# EAGLE design M307X (EAGLE 6.6.0)
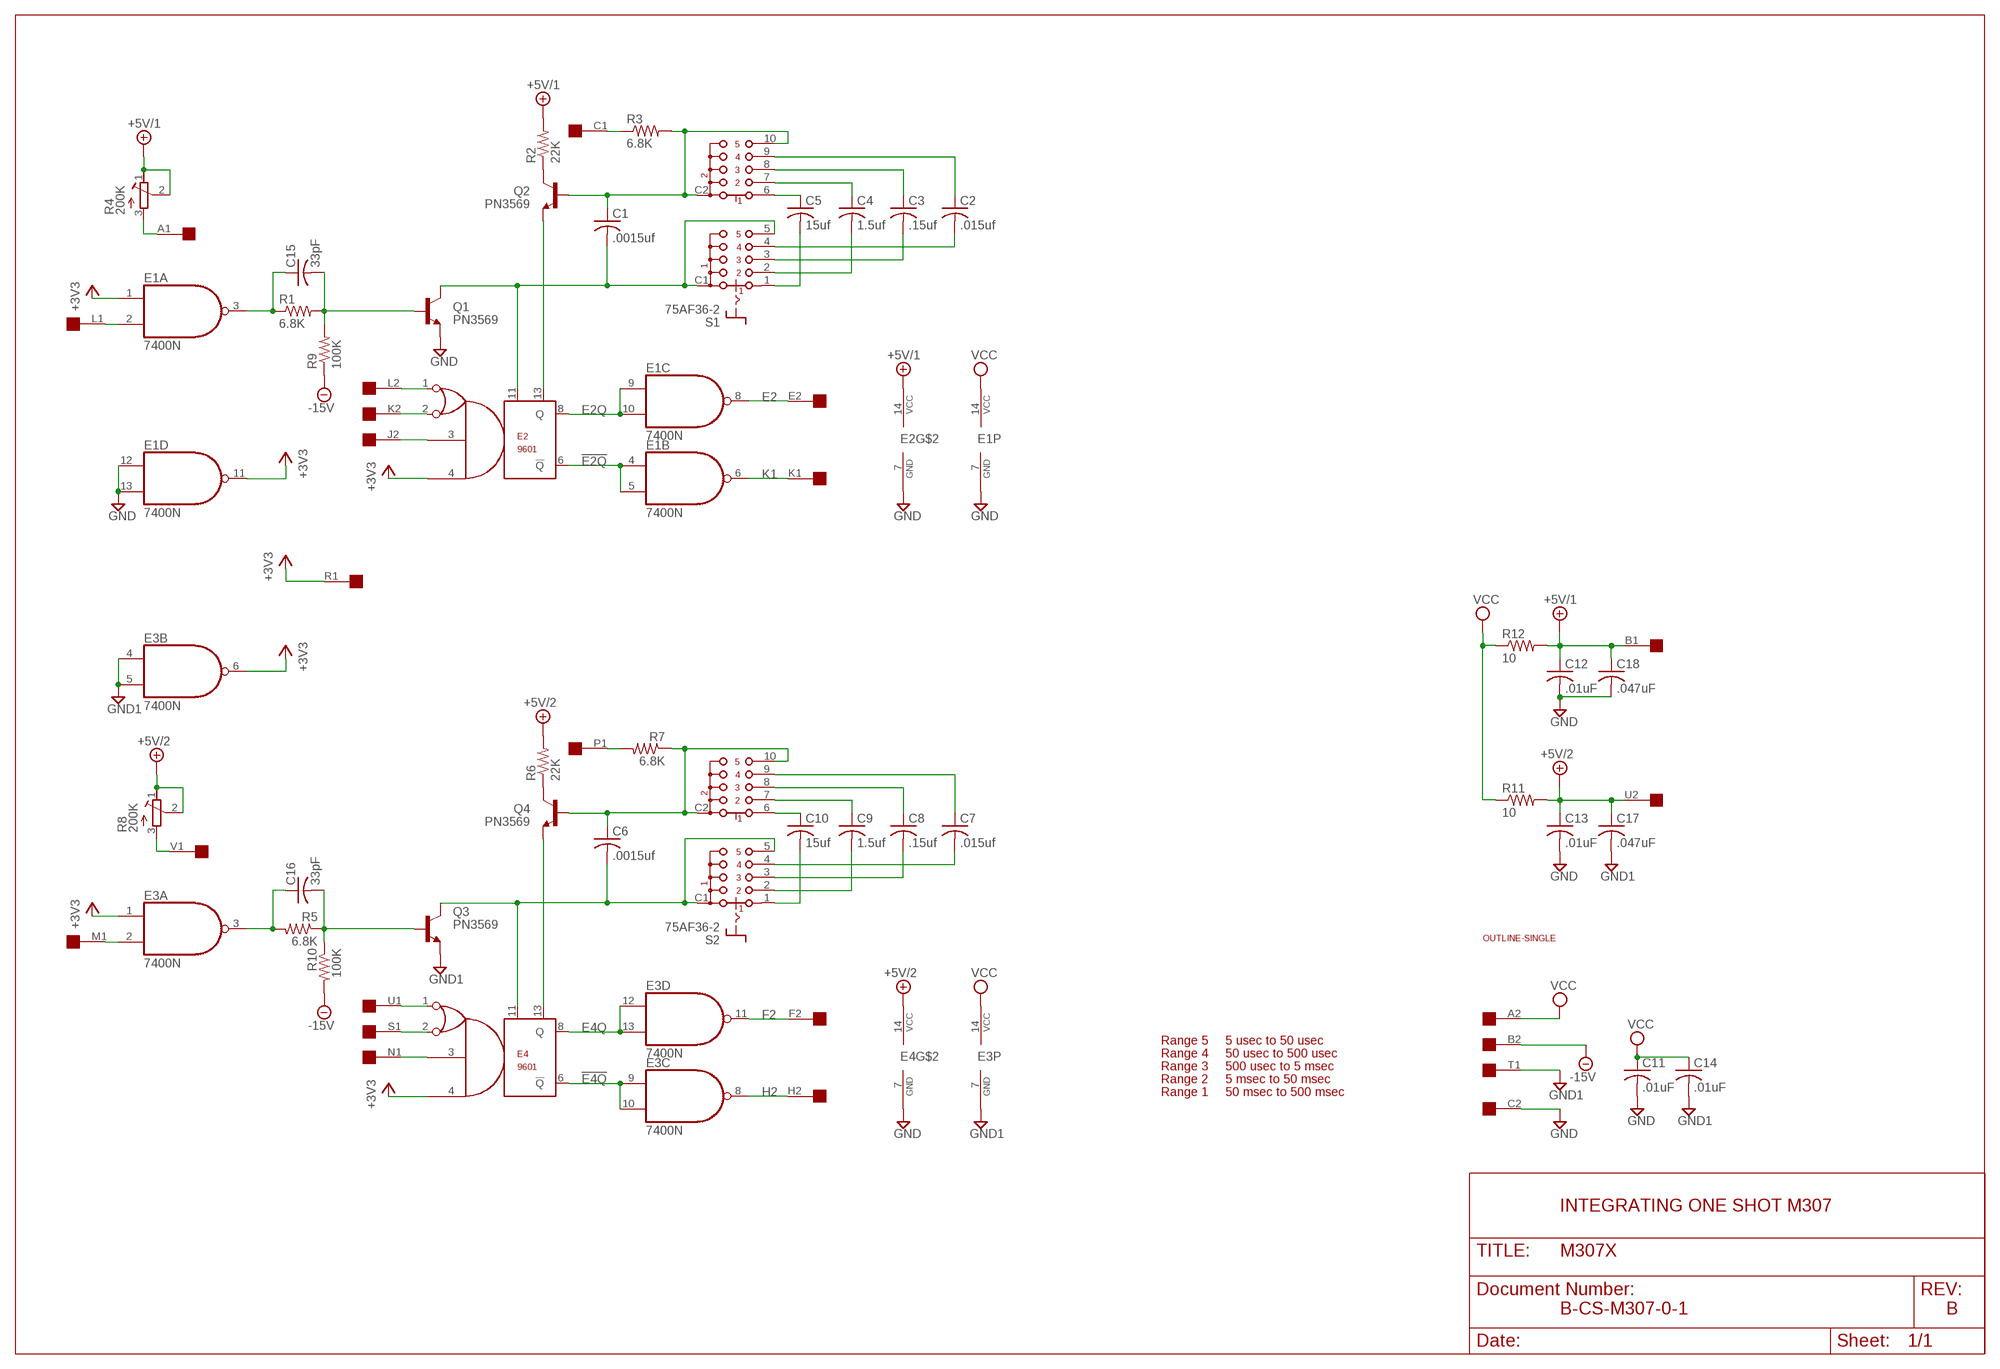
[diagram p0: schematic, sheet 1]

## Parts
C1  .0015uf  C-US050-025X075  [C050-025X075]
C2  .015uf  C-US150-054X183  [C150-054X183]
C3  .15uf  C-US150-054X183  [C150-054X183]
C4  1.5uf  C-US150-054X183  [C150-054X183]
C5  15uf  C-US150-054X183  [C150-054X183]
C6  .0015uf  C-US050-025X075  [C050-025X075]
C7  .015uf  C-US150-054X183  [C150-054X183]
C8  .15uf  C-US150-054X183  [C150-054X183]
C9  1.5uf  C-US150-054X183  [C150-054X183]
C10  15uf  C-US150-054X183  [C150-054X183]
C11  .01uF  C-US050-025X075  [C050-025X075]
C12  .01uF  C-US050-025X075  [C050-025X075]
C13  .01uF  C-US050-025X075  [C050-025X075]
C14  .01uF  C-US050-025X075  [C050-025X075]
C15  33pF  C-US050-025X075  [C050-025X075]
C16  33pF  C-US050-025X075  [C050-025X075]
C17  .047uF  C-US050-025X075  [C050-025X075]
C18  .047uF  C-US050-025X075  [C050-025X075]
E1  7400N  [DIL14]
E2  9601  [DIL14]
E3  7400N  [DIL14]
E4  9601  [DIL14]
Q1  PN3569  2N3019-NPN-TO39-EBC  [TO39]
Q2  PN3569  2N3019-NPN-TO39-EBC  [TO39]
Q3  PN3569  2N3019-NPN-TO39-EBC  [TO39]
Q4  PN3569  2N3019-NPN-TO39-EBC  [TO39]
R1  6.8K  R-US_0207/10  [0207/10]
R2  22K  R-US_0207/10  [0207/10]
R3  6.8K  R-US_0207/10  [0207/10]
R4  200K  275P  [3006Y]
R5  6.8K  R-US_0207/10  [0207/10]
R6  22K  R-US_0207/10  [0207/10]
R7  6.8K  R-US_0207/10  [0207/10]
R8  200K  275P  [3006Y]
R9  100K  R-US_0207/10  [0207/10]
R10  100K  R-US_0207/10  [0207/10]
R11  10  R-US_0207/10  [0207/10]
R12  10  R-US_0207/10  [0207/10]
S1  75AF36-2  [75AF36-2]
S2  75AF36-2  [75AF36-2]
U$1  OUTLINE-SINGLE  [SINGLE]
U$4  SINGLE  [EDGE-CON2]

## Nets
!E2Q: E1.4(B:I0) E1.5(B:I1) E2.6(!Q)
!E4Q: E3.9(C:I0) E3.10(C:I1) E4.6(!Q)
+3V3: E1.1(A:I0) E1.11(D:O) E2.4 E3.1(A:I0) E3.6(B:O) E4.4 U$4.R1
+5V/1: C12.1 C18.1 E2.14(VCC) R2.2 R4.1(A) R4.2(S) R12.2 U$4.B1
+5V/2: C13.1 C17.1 E4.14(VCC) R6.2 R8.1(A) R8.2(S) R11.2 U$4.U2
-15V: R9.1 R10.2 U$4.B2
A1: R8.3(E) U$4.V1
C1: R3.1 U$4.C1
E2: E1.8(C:O) U$4.E2
E2Q: E1.9(C:I0) E1.10(C:I1) E2.8(Q)
E4Q: E3.12(D:I0) E3.13(D:I1) E4.8(Q)
F2: E3.11(D:O) U$4.F2
GND [power]: C11.2 C12.2 C13.2 C18.2 E1.7(P:GND) E1.12(D:I0) E1.13(D:I1) E2.7(GND) E4.7(GND) Q1.1(E) U$4.C2
GND1 [power]: C14.2 C17.2 E3.4(B:I0) E3.5(B:I1) E3.7(P:GND) Q3.1(E) U$4.T1
H2: E3.8(C:O) U$4.H2
J1: C16.2 Q3.2(B) R5.1 R10.1
J2: E2.3 U$4.J2
K1: E1.6(B:O) U$4.K1
K2: E2.2 U$4.K2
L1: E1.2(A:I1) U$4.L1
L2: E2.1 U$4.L2
M1: E3.2(A:I1) U$4.M1
N1: E4.3 U$4.N1
N$1: E4.13 Q4.1(E)
N$2: C15.1 E1.3(A:O) R1.1
N$3: C16.1 E3.3(A:O) R5.2
N$4: C5.1 S1.6
N$5: C6.2 E4.11 Q3.3(C) S2.5 S2.C1
N$6: C4.1 S1.7
N$7: C3.1 S1.8
N$8: C2.1 S1.9
N$9: C2.2 S1.4
N$10: C3.2 S1.3
N$11: C4.2 S1.2
N$12: C5.2 S1.1
N$13: C10.1 S2.6
N$14: C9.1 S2.7
N$15: C8.1 S2.8
N$16: C7.1 S2.9
N$17: C10.2 S2.1
N$18: C9.2 S2.2
N$19: C8.2 S2.3
N$20: C7.2 S2.4
N$21: C1.1 Q2.2(B) R3.2 S1.10 S1.C2
N$22: C1.2 E2.11 Q1.3(C) S1.5 S1.C1
N$24: C6.1 Q4.2(B) R7.1 S2.10 S2.C2
N$25: E2.13 Q2.1(E)
N$26: Q2.3(C) R2.1
N$28: Q4.3(C) R6.1
N$29: C15.2 Q1.2(B) R1.2 R9.2
P1: R7.2 U$4.P1
S1: E4.2 U$4.S1
U1: E4.1 U$4.U1
V1: R4.3(E) U$4.A1
VCC [power]: C11.1 C14.1 E1.14(P:VCC) E3.14(P:VCC) R11.1 R12.1 U$4.A2
Unconnected: U$4.D1 U$4.D2 U$4.E1 U$4.F1 U$4.H1 U$4.J1 U$4.M2 U$4.N2 U$4.P2 U$4.R2 U$4.S2 U$4.T2 U$4.V2

## Notes on the sheet
- Range 5 | 5 usec to 50 usec
- Range 4 | 50 usec to 500 usec
- Range 3 | 500 usec to 5 msec
- Range 2 | 5 msec to 50 msec
- Range 1 | 50 msec to 500 msec
- INTEGRATING ONE SHOT M307
- B-CS-M307-0-1 | B

## Library data of the parts
C1-C18 = rcl:C-US: CAPACITOR, American symbol
E1 E3 = 74xx-us:74*00: Quad 2-input NAND gate
E2 E4 = dec-con:9601: DEC9601 monstable
Q1-Q4 = transistor:*-NPN-: NPN Transistror BF959 corrected 2008.03.06
R1-R3 R5-R7 R9-R12 = rcl:R-US_: RESISTOR, American symbol
R4 R8 = dec-con:275P: Trimpot with 275P (3006Y) footprint.
S1 S2 = dec-con:75?36-2: Single Deck Rotary Switches Source: www.grayhill.com .. J-13-14.pdf
U$1 = dec-con:OUTLINE-*: Board outlines for DEC boards.
U$4 = dec-con:SINGLE: Single-Height DEC board

## Net classes
1 power: width 0.813 mm

## Board
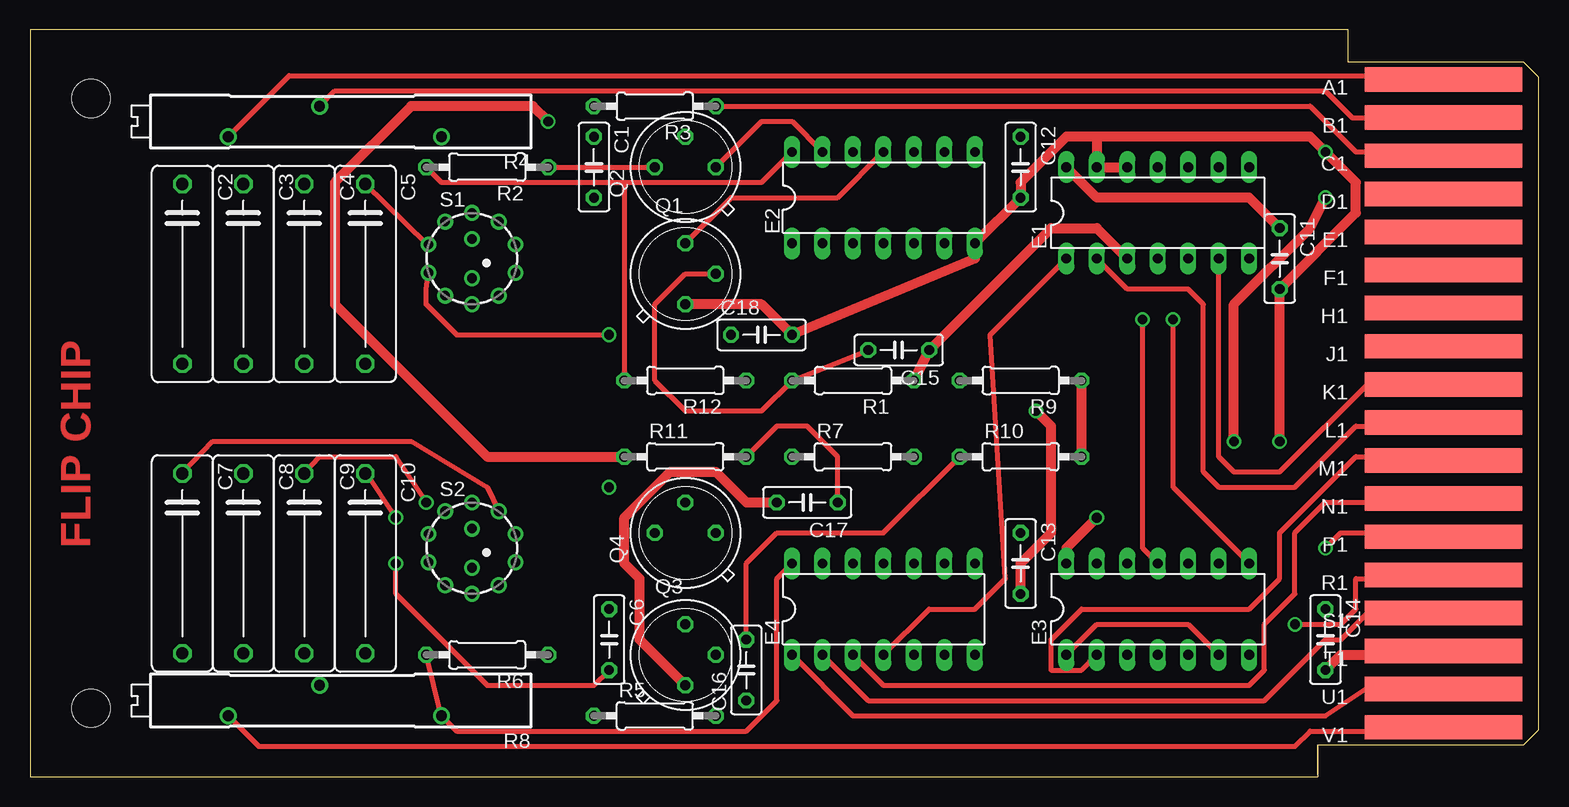
[diagram p1: board, top side]
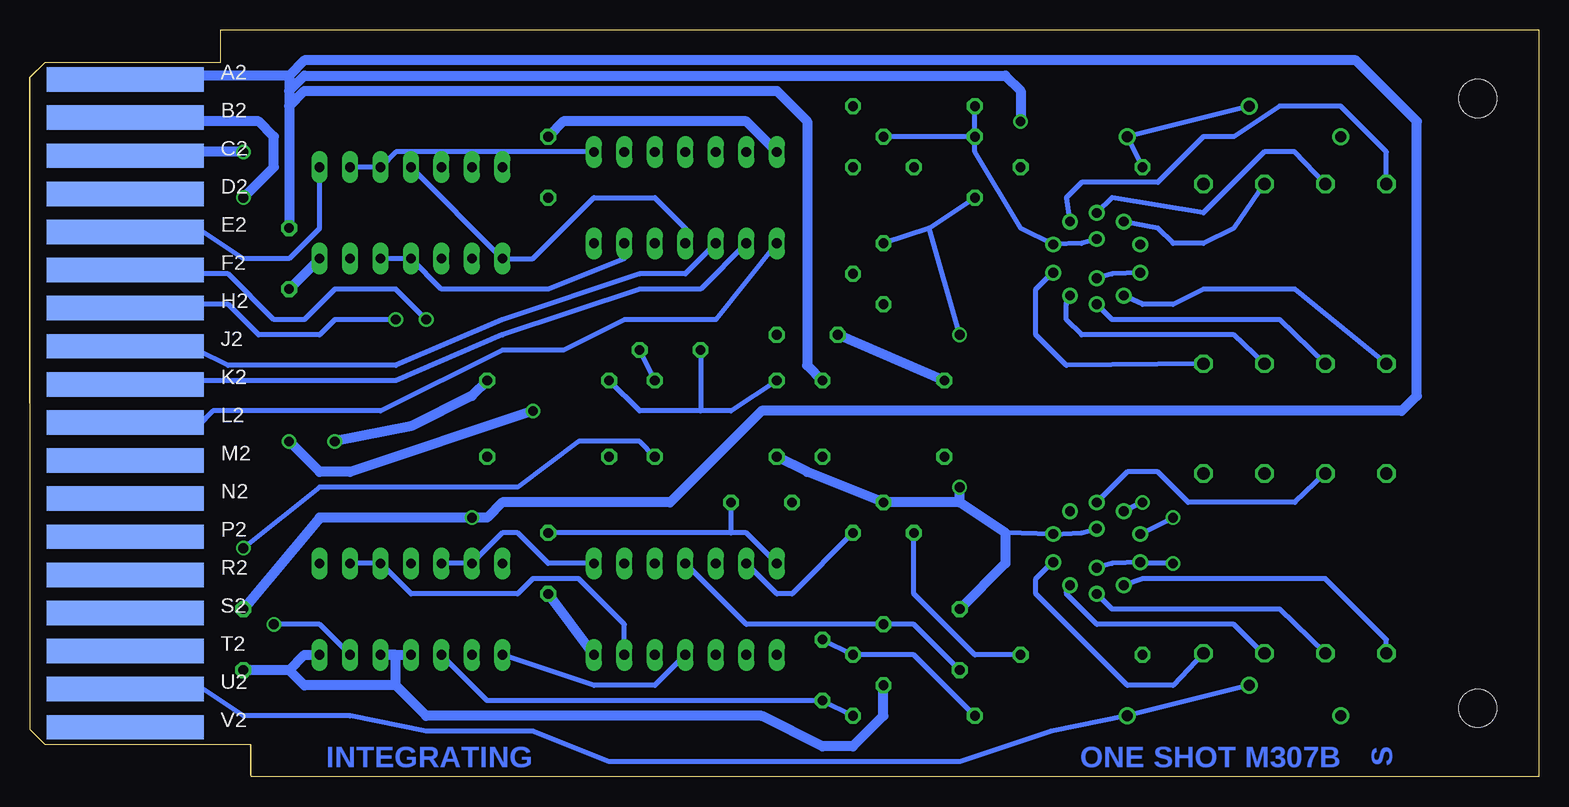
[diagram p2: board, bottom side, seen from below]

Size 125.73 x 62.23 mm. Coordinates in mm from the lower left corner, seen from the top.
Copper layers (1+16): Top 0.035mm / dielectric 1.5mm / Bottom 0.035mm
Design rules "16mils": minimum track width 16mil, minimum drill 32mil, track to track 15mil, track to pad 10mil, pad to pad 10mil, via to via 10mil, smd to smd 10mil, copper to edge 13mil, drill to drill 10mil, minimum pad ring 10mil, minimum via ring 8mil, stop-mask expansion 0mil, vias tented up to drill 0mil, thermal gap 10mil

### Footprints (pad centres in the part's own frame; a part is rotated, then mirrored left to right if it is on the bottom)
C050-025X075 = drill 0.813 octagon: 1 -2.54,0; 2 2.54,0
C150-054X183 = drill 1.016 octagon: 1 -7.493,0; 2 7.493,0
DIL14 = drill 0.813 long: 1 -7.62,-3.81; 2 -5.08,-3.81; 3 -2.54,-3.81; 4 0,-3.81; 5 2.54,-3.81; 6 5.08,-3.81; 7 7.62,-3.81; 8 7.62,3.81; 9 5.08,3.81; 10 2.54,3.81; 11 0,3.81; 12 -2.54,3.81; 13 -5.08,3.81; 14 -7.62,3.81
TO39 = drill 0.813 octagon: 1 0,-2.54; 2 2.54,0; 3 0,2.54
0207/10 = drill 0.813 octagon: 1 -5.08,0; 2 5.08,0
3006Y = drill 0.9: 1 -8.89,1.27; 2 1.27,-1.27; 3 8.89,1.27
75AF36-2 = drill 0.813: 1 3.623,-1.177; 2 2.239,-3.082; 3 0,-3.81; 4 -2.239,-3.082; 5 -3.623,-1.177; 6 -3.623,1.177; 7 -2.239,3.082; 8 0,3.81; 9 2.239,3.082; 10 3.623,1.177; C1 0,-1.63; C2 0,1.63
SINGLE = hole 3.175: 120.65,56.515; 120.65,5.715
EDGE-CON2 = smd 13.106 x 2.032: A1 7.938,4.128; B1 7.938,7.303; C1 7.938,10.477; D1 7.938,13.652; E1 7.938,16.828; F1 7.938,20.003; H1 7.938,23.177; J1 7.938,26.352; K1 7.938,29.527; L1 7.938,32.703; M1 7.938,35.877; N1 7.938,39.053; P1 7.938,42.227; R1 7.938,45.403; S1 7.938,48.578; T1 7.938,51.752; U1 7.938,54.928; V1 7.938,58.102 | smd 13.106 x 2.032 bottom: A2 7.938,4.128; B2 7.938,7.303; C2 7.938,10.477; D2 7.938,13.652; E2 7.938,16.828; F2 7.938,20.003; H2 7.938,23.177; J2 7.938,26.352; K2 7.938,29.527; L2 7.938,32.703; M2 7.938,35.877; N2 7.938,39.053; P2 7.938,42.227; R2 7.938,45.403; S2 7.938,48.578; T2 7.938,51.752; U2 7.938,54.928; V2 7.938,58.102

### Placement (x,y rotation side)
C1  46.99,50.8 270 top
C2  12.7,41.91 270 top
C3  17.78,41.91 270 top
C4  22.86,41.91 270 top
C5  27.94,41.91 270 top
C6  48.26,11.43 270 top
C7  12.7,17.78 270 top
C8  17.78,17.78 270 top
C9  22.86,17.78 270 top
C10  27.94,17.78 270 top
C11  104.14,43.18 270 top
C12  82.55,50.8 270 top
C13  82.55,17.78 270 top
C14  107.95,11.43 270 top
C15  72.39,35.56 180 top
C16  59.69,8.89 90 top
C17  64.77,22.86 180 top
C18  60.96,36.83 0 top
E1  93.98,46.99 0 top
E2  71.12,48.26 0 top
E3  93.98,13.97 0 top
E4  71.12,13.97 0 top
Q1  54.61,41.91 0 top
Q2  54.61,50.8 90 top
Q3  54.61,10.16 0 top
Q4  54.61,20.32 90 top
R1  68.58,33.02 180 top
R2  38.1,50.8 180 top
R3  52.07,55.88 180 top
R4  25.4,54.61 180 top
R5  52.07,5.08 0 top
R6  38.1,10.16 180 top
R7  68.58,26.67 0 top
R8  25.4,6.35 180 top
R9  82.55,33.02 180 top
R10  82.55,26.67 0 top
R11  54.61,26.67 0 top
R12  54.61,33.02 180 top
S1  36.83,43.18 0 top
S2  36.83,19.05 0 top
U$1  125.73,62.23 180 top
U$3  [FLIPCHIP]  0,0 0 top
U$4  125.73,62.23 180 top

### Tracks (layer width: path | path; a pad name or v marks a point on that pad's centre or on a via)
!E2Q
  Bottom 0.406: E1.5 E1.4 91.44,40.64 82.55,40.64 76.2,43.18 E2.6
!E4Q
  Bottom 0.406: E3.9 E3.10 93.98,15.24 85.09,15.24 83.82,16.51 80.01,16.51 76.2,12.7 E4.6
+3V3  (via drill 0.81)
  Top 0.406: v105.41,12.7 109.22,12.7 110.49,13.97 110.49,16.51 116.84,16.51 U$4.R1 | E3.1 88.9,12.7 96.52,12.7 E3.6 | E1.1 80.01,36.83 81.28,16.51 78.74,13.97 74.93,13.97 E4.4
  Bottom 0.406: E4.4 73.66,7.62 78.74,7.62 E3.1 | E2.4 71.12,45.72 73.66,48.26 78.74,48.26 83.82,43.18 E1.1 E1.11 | E3.6 101.6,12.7 v105.41,12.7
+5V/1
  Top 0.406: U$4.B1 110.2,54.9 107.95,57.15 25.4,57.15 R4.2 | R2.2 34.29,49.53 49.53,49.53 | 49.53,49.53 60.96,49.53 E2.14 | 49.53,49.53 R12.2
  Bottom 0.406: R4.2 R4.1 R2.2
  Bottom 0.813: C12.1 81.28,54.61 66.04,54.61 E2.14 | R12.2 C18.1
+5V/2
  Top 0.406: R6.2 R8.1 35.56,3.81 59.69,3.81 62.23,6.35 62.23,16.51 E4.14 | R11.2 62.23,29.21 64.77,29.21 67.31,26.67 C17.1
  Bottom 0.406: U$4.U2 116.84,7.62 111.76,7.62 107.95,5.08 99.06,5.08 92.71,3.81 83.82,3.81 77.47,1.27 48.26,1.27 40.64,3.81 R8.1 R8.2 | 67.31,20.32 66.04,20.32 E4.14 | 67.31,20.32 C13.1 | 67.31,20.32 C17.1
-15V  (via drill 0.81)
  Top 0.813: v107.95,48.26 106.68,45.72 100.33,39.37 v100.33,27.94 | R10.2 R9.1
  Bottom 0.813: U$4.B2 117.13,54.9 116.84,54.61 106.68,54.61 105.41,53.34 105.41,50.8 v107.95,48.26 | v100.33,27.94 93.98,29.21 88.9,31.75 R9.1
A1
  Top 0.406: U$4.V1 116.84,3.81 106.68,3.81 105.41,2.54 19.05,2.54 R8.3
C1
  Top 0.406: U$4.C1 116.84,52.07 110.49,52.07 106.68,55.88 R3.1
E2
  Bottom 0.406: U$4.E2 116.84,45.72 111.76,45.72 107.95,43.18 104.14,43.18 101.6,45.72 E1.8
E2Q
  Bottom 0.406: E1.9 E1.10 95.25,52.07 E2.8
E4Q
  Bottom 0.406: E3.12 E3.13 86.36,20.32 85.09,20.32 82.55,17.78 E4.8
F2  (via drill 0.81)
  Top 0.406: E3.11 92.71,19.05 v92.71,38.1
  Bottom 0.406: U$4.F2 117.12,42.19 116.84,41.91 109.22,41.91 105.41,38.1 102.87,38.1 100.33,40.64 95.25,40.64 v92.71,38.1
GND  (via drill 0.81)
  Top 0.813: E1.12 E1.13 88.9,53.34 | v104.14,27.94 C11.2 110.49,46.99 110.49,49.53 v107.95,52.07 106.68,53.34 88.9,53.34 | Q1.1 60.96,39.37 C18.2 78.74,43.18 E2.7 C12.2 82.55,49.53 86.36,53.34 88.9,53.34 | v83.82,30.48 85.09,29.21 85.09,20.32 82.55,17.78 C13.2
  Bottom 0.813: U$4.C2 117.17,51.74 116.84,52.07 v107.95,52.07 | E4.7 C13.2 | v104.14,27.94 101.6,25.4 99.06,25.4 v83.82,30.48 | C11.2 E1.7
GND1
  Top 0.813: U$4.T1 116.84,10.16 109.22,10.16 C14.2 | Q3.1 50.8,11.43 50.8,16.51 49.53,17.78 49.53,21.59 53.34,25.4 57.15,25.4 59.69,22.86 C17.2
  Bottom 0.813: E3.4 E3.5 95.25,10.16 95.25,7.62 | Q3.1 54.61,5.08 57.15,2.54 59.69,2.54 64.77,5.08 92.71,5.08 95.25,7.62 | 95.25,7.62 102.87,7.62 104.14,8.89 | 104.14,8.89 C14.2 | E3.7 102.87,10.16 104.14,8.89
H2  (via drill 0.81)
  Top 0.406: E3.8 95.25,24.13 v95.25,38.1
  Bottom 0.406: U$4.H2 117.17,39.04 116.84,39.37 109.22,39.37 106.68,36.83 101.6,36.83 100.33,38.1 v95.25,38.1
J1
  Top 0.406: C16.2 59.69,17.78 62.23,20.32 71.12,20.32 R10.1
  Bottom 0.406: R5.1 52.07,10.16 Q3.2 C16.2
J2
  Bottom 0.406: U$4.J2 116.84,35.56 111.76,35.56 109.22,34.29 95.25,34.29 86.36,38.1 74.93,41.91 71.12,41.91 E2.3
K1
  Top 0.406: U$4.K1 116.84,33.02 111.76,33.02 104.14,25.4 100.33,25.4 99.06,26.67 E1.6
K2
  Bottom 0.406: E2.2 69.85,40.64 74.93,40.64 86.36,36.83 95.25,33.02 116.84,33.02 U$4.K2
L1
  Top 0.406: U$4.L1 116.84,29.21 110.49,29.21 105.41,24.13 99.06,24.13 97.79,25.4 97.79,39.37 96.52,40.64 91.44,40.64 E1.2
L2
  Bottom 0.406: U$4.L2 115.9,29.54 115.57,29.21 111.76,29.21 110.49,30.48 96.52,30.48 86.36,35.56 81.28,35.56 76.2,38.1 68.58,38.1 E2.1
M1
  Top 0.406: U$4.M1 116.84,26.67 110.49,26.67 104.14,20.32 104.14,16.51 101.6,13.97 87.63,13.97 85.09,11.43 85.09,8.89 87.63,8.89 E3.2
N1
  Top 0.406: U$4.N1 116.84,22.86 107.95,22.86 105.41,20.32 105.41,15.24 102.87,12.7 102.87,8.89 101.6,7.62 71.12,7.62 E4.3
N$1
  Bottom 0.406: Q4.1 62.23,15.24 63.5,15.24 E4.13
N$2
  Top 0.813: R1.1 C15.1 85.09,45.72 88.9,45.72 E1.3
  Bottom 0.406: R1.1 C15.1
N$3
  Bottom 0.406: R5.2 C16.1 87.63,6.35 E3.3
N$4
  Top 0.406: S1.6 33.02,44.45 C5.1
N$5  (via drill 0.81)
  Top 0.406: C6.2 46.99,7.62 38.1,7.62 30.48,15.24 v30.48,17.78
  Bottom 0.406: v30.48,17.78 33.02,17.78 S2.5 35.56,17.78 S2.C1 | C6.2 52.07,12.7 Q3.3 66.04,12.7 E4.11
N$6
  Bottom 0.406: C4.1 25.4,45.72 27.94,44.45 30.48,44.45 31.75,45.72 S1.7
N$7
  Bottom 0.406: C3.1 20.32,52.07 22.86,52.07 27.94,46.99 35.56,48.26 S1.8 | S1.8
N$8
  Bottom 0.406: C2.1 12.7,52.07 16.51,55.88 21.59,55.88 25.4,53.34 27.94,53.34 31.75,49.53 38.1,49.53 39.37,48.26 S1.9
N$9
  Bottom 0.406: C2.2 20.32,40.64 27.94,40.64 30.48,39.37 33.02,39.37 S1.4
N$10
  Bottom 0.406: C3.2 21.59,38.1 35.56,38.1 S1.3 | S1.3
N$11
  Bottom 0.406: C4.2 25.4,36.83 38.1,36.83 39.37,38.1 39.37,39.37 S1.2
N$12
  Bottom 0.406: C5.2 39.37,34.29 41.91,36.83 41.91,40.64 40.64,41.91 S1.1
N$13  (via drill 0.81)
  Top 0.406: C10.1 27.94,25.4 v30.48,21.59
  Bottom 0.406: v30.48,21.59 S2.6
N$14  (via drill 0.81)
  Top 0.406: C9.1 24.13,26.67 30.48,26.67 v33.02,22.86
  Bottom 0.406: v33.02,22.86 S2.7
N$15
  Bottom 0.406: C8.1 20.32,22.86 29.21,22.86 31.75,25.4 34.29,25.4 S2.8 | S2.8
N$16
  Top 0.406: C7.1 15.24,27.94 31.75,27.94 38.1,24.13 S2.9
N$17
  Bottom 0.406: C10.2 30.48,7.62 34.29,7.62 41.91,15.24 41.91,16.51 40.64,17.78 S2.1
N$18
  Bottom 0.406: S2.2 39.37,15.24 36.83,12.7 25.4,12.7 22.86,10.16 C9.2
N$19
  Bottom 0.406: C8.2 21.59,13.97 35.56,13.97 S2.3
N$20
  Bottom 0.406: C7.2 12.7,11.43 17.78,16.51 33.02,16.51 S2.4
N$21
  Bottom 0.406: S1.C2 38.1,44.45 S1.10 43.18,45.72 46.99,52.07 C1.1 | C1.1 Q2.2 | C1.1 R3.2
N$22  (via drill 0.81)
  Top 0.406: v48.26,36.83 35.56,36.83 33.02,39.37 33.02,40.64 S1.5 | Q1.3 58.42,48.26 67.31,48.26 E2.11
  Bottom 0.406: S1.5 35.56,41.91 S1.C1 | 50.8,45.72 C1.2 | 50.8,45.72 Q1.3 | v48.26,36.83 50.8,45.72
N$24  (via drill 0.81)
  Bottom 0.406: S2.C2 38.1,20.32 S2.10 44.45,20.32
  Bottom 0.813: 48.26,22.86 Q4.2 60.96,25.4 R7.1 | 48.26,22.86 v48.26,24.13 | C6.1 44.45,17.78 44.45,20.32 48.26,22.86
N$25
  Top 0.406: Q2.1 60.96,54.61 63.5,54.61 E2.13
N$26
  Top 0.406: R2.1 Q2.3
N$28
  Bottom 0.406: R6.1 46.99,10.16 52.07,15.24 Q4.3
N$29
  Top 0.406: Q1.2 54.61,41.91 52.07,39.37 52.07,33.02 54.61,30.48 60.96,30.48 R1.2 C15.2
  Bottom 0.406: R9.2 74.93,30.48 69.85,30.48 | C15.2 69.85,30.48 | 69.85,30.48 67.31,30.48 R1.2
P1  (via drill 0.81)
  Top 0.406: U$4.P1 116.84,20.32 109.22,20.32 v107.95,19.05
  Bottom 0.406: v107.95,19.05 101.6,24.13 85.09,24.13 80.01,27.94 74.93,27.94 R7.2
S1
  Top 0.406: E4.2 69.85,6.35 102.87,6.35 107.95,11.43 109.22,11.43 111.76,13.97 116.84,13.97 U$4.S1
U1
  Top 0.406: E4.1 68.58,5.08 107.95,5.08 111.76,7.62 116.84,7.62 U$4.U1
V1
  Top 0.406: R4.3 21.59,58.42 116.84,58.42 U$4.A1
VCC  (via drill 0.81)
  Top 0.813: v88.9,21.59 86.36,19.05 E3.14 | v43.18,54.61 41.91,55.88 31.75,55.88 25.4,49.53 25.4,39.37 38.1,26.67 R11.1 | C11.1 101.6,48.26 88.9,48.26 E1.14
  Bottom 0.813: U$4.A2 117.24,58.02 116.84,58.42 104.14,58.42 | 104.14,58.42 104.14,57.15 | 104.14,57.15 104.14,55.88 | 104.14,55.88 C11.1 | 104.14,57.15 102.87,58.42 44.45,58.42 43.18,57.15 v43.18,54.61 | 104.14,58.42 102.87,59.69 15.24,59.69 10.16,54.61 10.16,31.75 11.43,30.48 64.77,30.48 72.39,22.86 86.36,22.86 87.63,21.59 v88.9,21.59 101.6,21.59 C14.1 | R12.1 60.96,34.29 60.96,54.61 63.5,57.15 102.87,57.15 104.14,55.88

### Text on the board
Bottom: S | ONE SHOT M307B | INTEGRATING